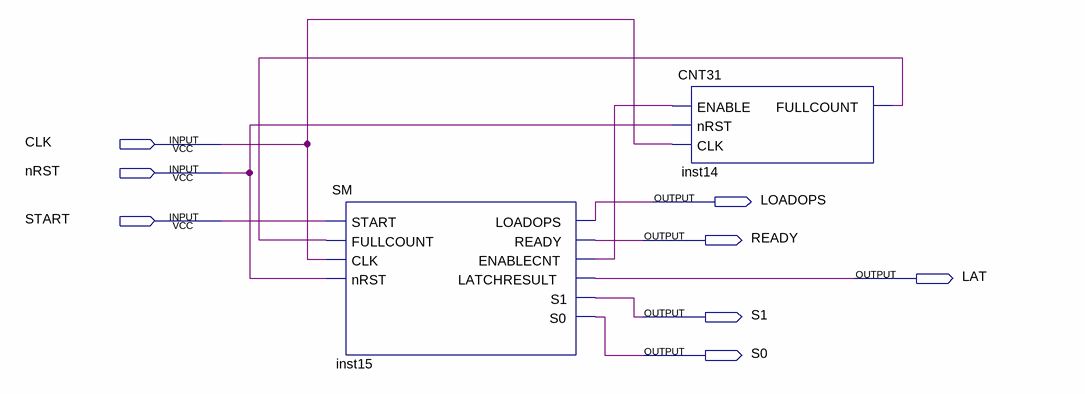
[diagram p0: schematic sheet]
// Quartus schematic TEST.bdf as structural Verilog: 2 symbols, 8 pins
module TEST (
  input  CLK,
  input  nRST,
  input  START,
  output LOADOPS,
  output READY,
  output LAT,
  output S1,
  output S0
);

  wire inst14_fullcount, inst15_enablecnt;

  SM inst15 (
    .START(START), .FULLCOUNT(inst14_fullcount), .CLK(CLK), .nRST(nRST), .LOADOPS(LOADOPS), .READY(READY),
    .ENABLECNT(inst15_enablecnt), .LATCHRESULT(LAT), .S1(S1), .S0(S0));
  CNT31 inst14 (.ENABLE(inst15_enablecnt), .nRST(nRST), .CLK(CLK), .FULLCOUNT(inst14_fullcount));
endmodule
